# Altium project ut_mbed_programmer.PrjPCB
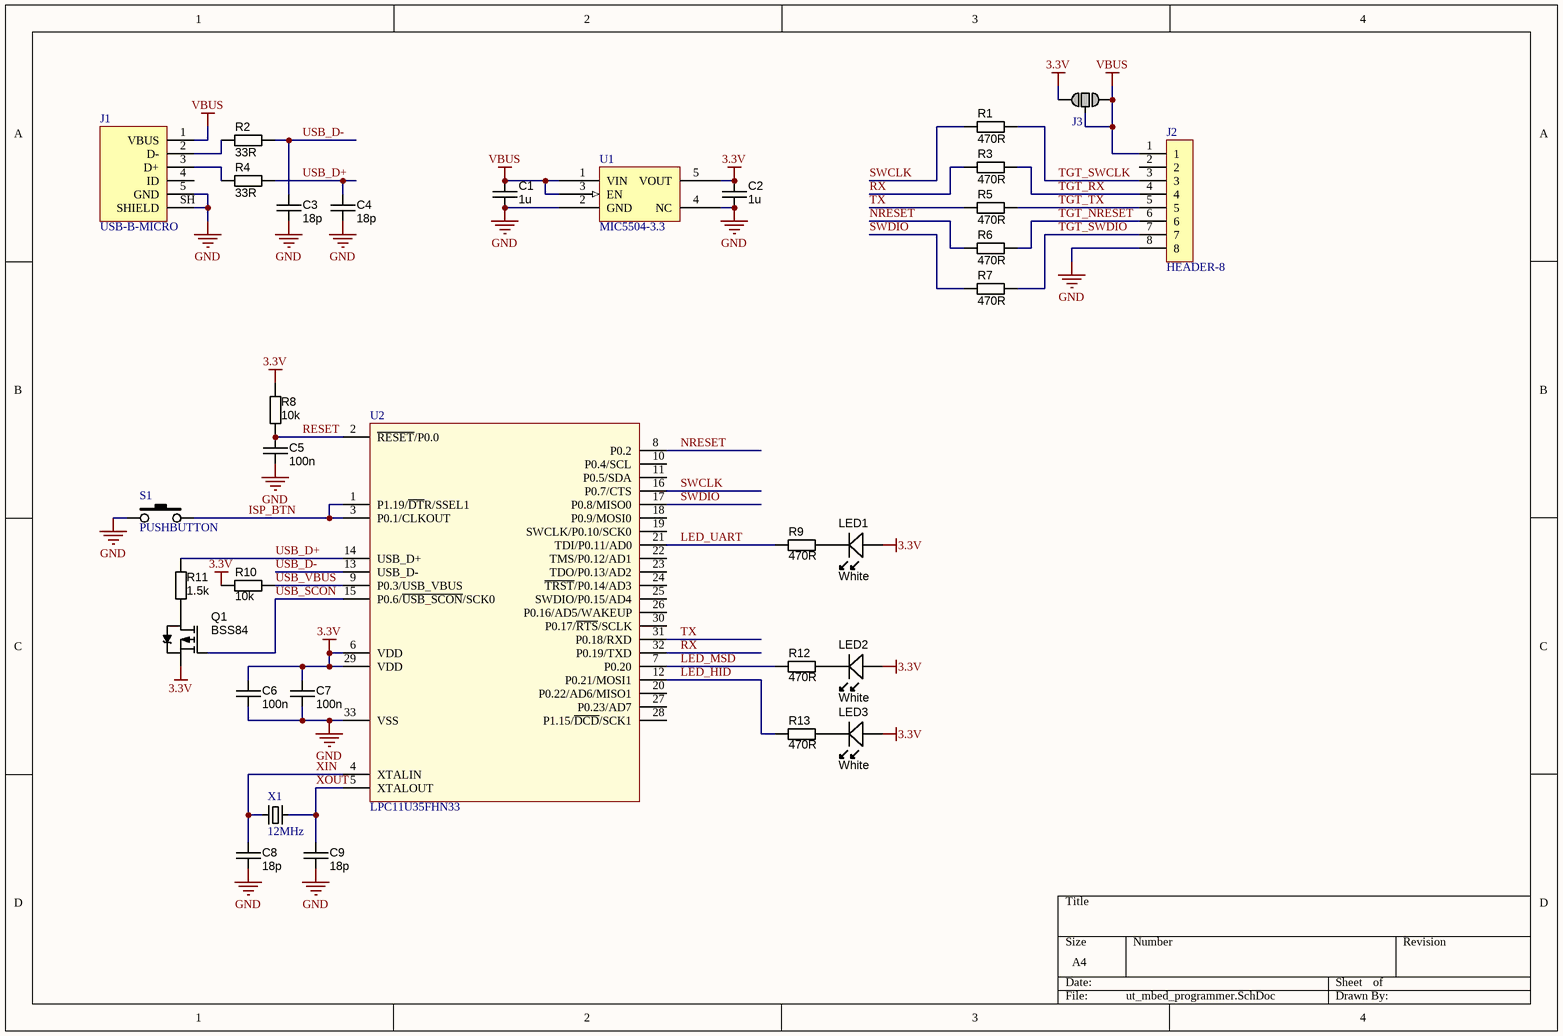
[diagram p0: ut_mbed_programmer.SchDoc]
1 sheet, 33 parts. Net scope: global (net labels, ports and power ports of the same name join across sheets).
Board file: ut_mbed_programmer.PcbDoc

## Sheet ut_mbed_programmer.SchDoc
size A4

### Parts
C1  1u  [CAPC1608X90N]
C2  1u  [CAPC1608X90N]
C3  18p  [CAPC1608X90N]
C4  18p  [CAPC1608X90N]
C5  100n  [CAPC1608X90N]
C6  100n  [CAPC1608X90N]
C7  100n  [CAPC1608X90N]
C8  18p  [CAPC1608X90N]
C9  18p  [CAPC1608X90N]
J1  USB-B-MICRO  [USB-B-MICRO-FCI-10104110]
J2  HEADER-8  [MICRO-MATCH-FOB-08]
J3  JUMPER  [JUMPER-SMD-3WAY-1005]  (value not drawn)
LED1  White  [LED-0603-WHITE]
LED2  White  [LED-0603-WHITE]
LED3  White  [LED-0603-WHITE]
Q1  BSS84  [SOT23-3]
R1  470R  [RESC1608X55N]
R2  33R  [RESC1608X55N]
R3  470R  [RESC1608X55N]
R4  33R  [RESC1608X55N]
R5  470R  [RESC1608X55N]
R6  470R  [RESC1608X55N]
R7  470R  [RESC1608X55N]
R8  10k  [RESC1608X55N]
R9  470R  [RESC1608X55N]
R10  10k  [RESC1608X55N]
R11  1.5k  [RESC1608X55N]
R12  470R  [RESC1608X55N]
R13  470R  [RESC1608X55N]
S1  PUSHBUTTON  [KMR421NGLFS]
U1  MIC5504-3.3  [SOT23-5]
U2  LPC11U35FHN33  [HVQFN33]
X1  12MHz  [XTAL-3.2x2.5]

### Nets
3.3V: C2.1 C6.1 C7.1 J3.3 LED1.A LED2.A LED3.A Q1.2(S) R8.1 R10.2 U1.5(VOUT) U2.6(VDD) U2.29(VDD)
GND: C1.2 C2.2 C3.2 C4.2 C5.2 C6.2 C7.2 C8.2 C9.2 J1.5(GND) J1.SH(SHIELD) J2.8 S1.1 U1.2(GND) U1.4(NC) U2.33(VSS)
VBUS: C1.1 J1.1(VBUS) J2.1 J3.1 J3.2 U1.1(VIN) U1.3(EN)
ISP_BTN: S1.2 U2.1(P1.19/~{DT}R/SSEL1) U2.3(P0.1/CLKOUT)
LED_HID: R13.1 U2.12(P0.21/MOSI1)
LED_MSD: R12.1 U2.7(P0.20)
LED_UART: R9.1 U2.21(TDI/P0.11/AD0)
NRESET: R6.1 U2.8(P0.2)
RESET: C5.1 R8.2 U2.2(~{RE}~{SET}/P0.0)
RX: R3.1 U2.32(P0.19/TXD)
SWCLK: R1.1 U2.16(P0.7/CTS)
SWDIO: R7.1 U2.17(P0.8/MISO0)
TGT_NRESET: J2.6 R6.2
TGT_RX: J2.4 R3.2
TGT_SWCLK: J2.3 R1.2
TGT_SWDIO: J2.7 R7.2
TGT_TX: J2.5 R5.2
TX: R5.1 U2.31(P0.18/RXD)
USB_D+: C4.1 R4.2 R11.1 U2.14(USB_D+)
USB_D-: C3.1 R2.2 U2.13(USB_D-)
USB_SCON: Q1.1(G) U2.15(P0.6/~{USB_SCON}/SCK0)
USB_VBUS: R10.1 U2.9(P0.3/USB_VBUS)
XIN: C8.1 U2.4(XTALIN) X1.1
XOUT: C9.1 U2.5(XTALOUT) X1.3
NetJ1_2: J1.2(D-) R2.1
NetJ1_3: J1.3(D+) R4.1
NetLED1_K: LED1.K R9.2
NetLED2_K: LED2.K R12.2
NetLED3_K: LED3.K R13.2
NetQ1_3: Q1.3(D) R11.2

Not connected (* = marked no-connect by the designer): J1 4(ID); J2 2; U2 10(P0.4/SCL) 11(P0.5/SDA) 18(P0.9/MOSI0) 19(SWCLK/P0.10/SCK0) 20(P0.22/AD6/MISO1) 22(TMS/P0.12/AD1) 23(TDO/P0.13/AD2) 24(~{TRST}/P0.14/AD3) 25(SWDIO/P0.15/AD4) 26(P0.16/AD5/WAKEUP) 27(P0.23/AD7) 28(P1.15/~{DCD}/SCK1) 30(P0.17/~{RTS}/SCLK)

### Library data of the parts
C1 C2 = CAPC_1u_0603_X7R_16V_10%: Capacitor SMD Cer 1uF 10% 16V X7R 0603; Manufacturer 1: TDK Corporation; Manufacturer Part Number 1: C1608X7R1C105K; Ratings: 16V; X7R; Material: ceramic; SCDType: spec; Value: 1µ; Package / Case: 0603 (1608 metric); Tolerance: ±10%; Supplier 1: Digi-Key; Supplier Part Number 1: 445-1604-1-ND; ComponentLink1URL: http://product.tdk.com/capacitor/mlcc/en/documents/mlcc_commercial_general_en.pdf; ComponentLink1Description: http://product.tdk.com/capacitor/mlcc/en/documents/mlcc_commercial_general_en.pdf
C3-C9 = CAPC_8p_0603_NP0_50V: Capacitor SMD Cer 8pF ±0.5pF 50V NP0 0603; Manufacturer 1: Murata Electronics North America; Manufacturer Part Number 1: GRM1885C1H8R0DZ01D; Ratings: 50V; NP0; SCDType: undef; Value: 8p; Tolerance: ±0.5pF; Operating Temperature: -55°C ~ 125°C; Package / Case: 0603 (1608 Metric); Size / Dimension: 0.063" L x 0.032" W (1.60mm x 0.81mm); Thickness (Max): 0.035" (0.90mm); Supplier 1: Digi-Key; Supplier Part Number 1: 490-1399-1-ND; ComponentLink1URL: http://search.murata.co.jp/Ceramy/image/img/PDF/ENG/GRM1885C1H8R0DZ01.pdf; ComponentLink1Description: GRM1885C1H8R0DZ01 datasheet.pdf
J3 = JUMPER-SMD-3WAY
LED1-LED3 = LED_SMD_White_0603_Bright: LED 0603 SMD Bright White 8700K; Manufacturer 1: Lite-On Inc; Manufacturer Part Number 1: LTW-C193TS5; Material: InGaN; Ratings: Ultra Bright; 8700K; Millicandela Rating: 230mcd; Voltage - Forward (Vf) Typ: 3.3V; Viewing Angle: 120°; Lens Type: Clear, Tinted; Lens Style/Size: Rectangle with Flat Top, 0.8mm x 1.1mm; Voltage - Forward (Vf) @ 10mA: 3.0V; SCDType: source; Package / Case: 0603 (1608 metric); Supplier 1: Digi-Key; Supplier Part Number 1: 160-1721-1-ND; Supplier 2: Digi-Key; Supplier Part Number 2: APT1608QWF/D-ND; Manufacturer 2: Kingbright Corp; Manufacturer Part Number 2: APT1608QWF/D; Color: White; Size / Dimension: 1.60mm L x 0.80mm W; Mounting Type: Surface Mount; Luminous Flux @ Current - Test: -; ComponentLink2URL: http://www.kingbrightusa.com/images/catalog/SPEC/APT1608QWF-D.pdf; ComponentLink2Description: http://www.kingbrightusa.com/images/catalog/SPEC/APT1608QWF-D.pdf; ComponentLink1URL: http://media.digikey.com/pdf/Data%20Sheets/Lite-On%20PDFs/LTW-C193TS5.pdf; ComponentLink1Description: http://media.digikey.com/pdf/Data%20Sheets/Lite-On%20PDFs/LTW-C193TS5.pdf
Q1 = MOSFET_BSS84: MOSFET SMD P-CH 50V 130mA SOT23-3; Manufacturer 1: Fairchild Semiconductor; Ratings: 50V; 130mA; Material: Metal Oxide; FET Type: MOSFET P-Channel, Metal Oxide; FET Feature: Logic Level Gate; Rds On (Max) @ Id, Vgs: 10 Ohm @ 100mA, 5V; Vgs(th) (Max) @ Id: 2V @ 1mA; Gate Charge (Qg) @ Vgs: 1.3nC @ 5V; Input Capacitance (Ciss) @ Vds: 73pF @ 25V; Power - Max: 360mW; SCDType: undef; Package / Case: SOT23-3; Supplier 1: Digi-Key; Supplier Part Number 1: BSS84CT-ND; Manufacturer Part Number 1: BSS84; Drain to Source Voltage (Vdss): 50V; Current - Continuous Drain (Id) @ 25° C: 130mA; Supplier Device Package: SOT-23; ComponentLink1URL: http://www.fairchildsemi.com/ds/BS/BSS84.pdf; ComponentLink1Description: http://www.fairchildsemi.com/ds/BS/BSS84.pdf
R1-R13 = RES_1K_0603_1%: Resistor SMD chip 1k Ohm 0.1W 1% 0603; Manufacturer 1: Yageo; Manufacturer Part Number 1: RC0603FR-071KL; Ratings: 1/10W; SCDType: spec; Package / Case: 0603 (1608 Metric); Supplier 1: Digi-Key; Supplier Part Number 1: 311-1.00KHRCT-ND; Tolerance: ±1%; Value: 1K
U1 = LDO-SOT23-5
X1 = XTAL-3.2X2.5